# EAGLE design Schematic (EAGLE 9.5.2)
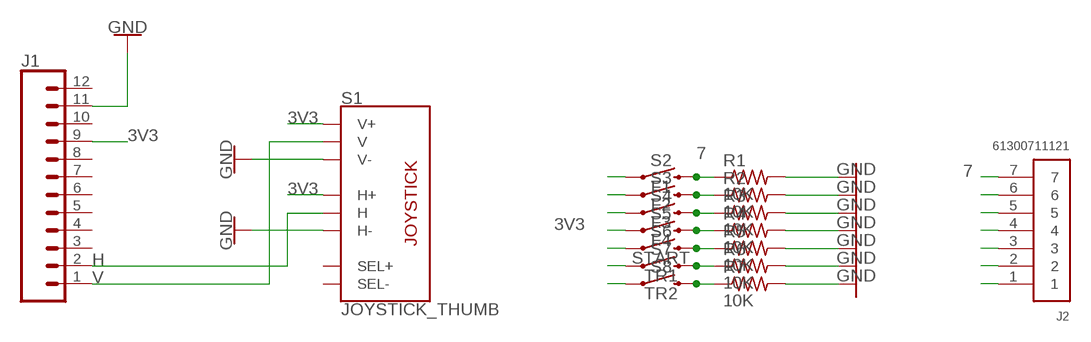
[diagram p0: schematic, sheet 1]

## Parts
J1  CONN_12NO_SILK  [1X12_NO_SILK]
J2  61300711121  [61300711121]
R1  10K  ERJ-8GEY0R00V  [RES_1206]
R2  10K  ERJ-8GEY0R00V  [RES_1206]
R3  10K  ERJ-8GEY0R00V  [RES_1206]
R4  10K  ERJ-8GEY0R00V  [RES_1206]
R5  10K  ERJ-8GEY0R00V  [RES_1206]
R6  10K  ERJ-8GEY0R00V  [RES_1206]
R7  10K  ERJ-8GEY0R00V  [RES_1206]
S1  JOYSTICK_THUMB  [JOYSTICK]
S2  F1  MOMENTARY-SWITCH-SPST-PTH-12MM  [TACTILE_SWITCH_PTH_12MM]
S3  F2  MOMENTARY-SWITCH-SPST-PTH-12MM  [TACTILE_SWITCH_PTH_12MM]
S4  F3  MOMENTARY-SWITCH-SPST-PTH-12MM  [TACTILE_SWITCH_PTH_12MM]
S5  F4  MOMENTARY-SWITCH-SPST-PTH-12MM  [TACTILE_SWITCH_PTH_12MM]
S6  START  MOMENTARY-SWITCH-SPST-PTH-12MM  [TACTILE_SWITCH_PTH_12MM]
S7  TR1  MOMENTARY-SWITCH-SPST-PTH-RIGHT-ANGLE-KIT  [TACTILE_SWITCH_PTH_RIGHT_ANGLE_KIT]
S8  TR2  MOMENTARY-SWITCH-SPST-PTH-RIGHT-ANGLE-KIT  [TACTILE_SWITCH_PTH_RIGHT_ANGLE_KIT]

## Nets
1: J2.1 R7.1 S8.2
2: J2.2 R6.1 S7.2
3: J2.3 R5.1 S6.3
3V3: J1.9 S1.H1(H+) S1.V1(V+) S2.1 S3.1 S4.1 S5.1 S6.1 S7.1 S8.1
4: J2.4 R4.1 S5.3
5: J2.5 R3.1 S4.3
6: J2.6 R2.1 S3.3
7: J2.7 R1.1 S2.3
GND: J1.11 R1.2 R2.2 R3.2 R4.2 R5.2 R6.2 R7.2 S1.H3(H-) S1.V3(V-)
H: J1.2 S1.H2(H)
V: J1.1 S1.V2(V)
Unconnected: J1.3 J1.4 J1.5 J1.6 J1.7 J1.8 J1.10 J1.12 S1.B1A(SEL+) S1.B2A(SEL-)

## Library data of the parts
J1 = SparkFun-Connectors:CONN_12: Multi connection point. Often used as Generic Header-pin footprint for 0.1 inch spaced/style header connections On any of the 0.1 inch spaced packages, you can populate with these: Break Away Headers - Straight <https://www.sparkfun.com/products/116> (PRT-00116) Break Away Male Headers - Right Angle <https://www.sparkfun.com/products/553> (PRT-00553) Female Headers <https://www.sparkfun.com/products/115> (PRT-00115) Break Away Headers - Machine Pin <https://www.sparkfun.com/products/117> (PRT-00117) Break Away Female Headers - Swiss Machine Pin <https://www.sparkfun.com/products/743> (PRT-00743) For SCREWTERMINALS and SPRING TERMINALS visit here: Screw Terimnals on SparkFun.com <https://www.sparkfun.com/search/results?term=Screw+Terminals> (5mm/3.5mm/2.54mm spacing) This device is also useful as a general connection point to wire up your design to another part of your project. Our various solder wires solder well into these plated through hole pads. Hook-Up Wire - Assortment (Stranded, 22 AWG) <https://www.sparkfun.com/products/11375> (PRT-11375) Hook-Up Wire - Assortment (Solid Core, 22 AWG) <https://www.sparkfun.com/products/11367> (PRT-11367) View the entire wire category on our website here <https://www.sparkfun.com/categories/141> Special notes: Molex polarized connector foot print use with SKU : PRT-08231 with associated crimp pins and housings. 1MM SMD Version SKU: PRT-10208 NOTES ON THE VARIANTS LOCK and LOCK_LONGPADS... This footprint was designed to help hold the alignment of a through-hole component (i.e. 6-pin header) while soldering it into place. You may notice that each hole has been shifted either up or down by 0.005 of an inch from it's more standard position (which is a perfectly straight line). This slight alteration caused the pins (the squares in the middle) to touch the edges of the holes. Because they are alternating, it causes a "brace" to hold the component in place. 0.005 has proven to be the perfect amount of "off-center" position when using our standard breakaway headers. Although looks a little odd when you look at the bare footprint, once you have a header in there, the alteration is very hard to notice. Also,if you push a header all the way into place, it is covered up entirely on the bottom side.
J2 = Headers:61300711121: CONN HEADER VERT 7POS 2.54MM Manufacturer's datasheet <https://katalog.we-online.de/em/datasheet/6130xx11121.pdf>; CREATED_BY: PCBLayout.com; DIGI_KEY_PART_NUMBER: 732-5320-ND; MANUFACTURER: Wurth Electronics Inc.; MPN: 61300711121
R1-R7 = Resistor_Capacitor:ERJ-8GEY0R00V: RES SMD 0 OHM JUMPER 1/4W 1206 Manufacturer's datasheet <https://industrial.panasonic.com/ww/products/resistors/chip-resistors/general-purpose-chip-resistors/thick-film-chip-resistors/ERJ8GEY0R00V>; CREATED_BY: PCBLayout.com; DIGIKEY_PART_NUMBER: P0.0ETR-ND; MANUFACTURER: Panasonic Electronic Components; MPN: ERJ-8GEY0R00V; PACKAGE: SMD 1206
S1 = SparkFun-Switches:JOYSTICK_THUMB: Analog Thumb Joystick This is a joystick very similar to the ‘analog’ joysticks on PS2 (PlayStation 2) controllers. Directional movements are simply two potentiometers - one for each axis. Pots are ~10k each. This joystick also has a select button that is actuated when the joystick is pressed down. SparkFun Products Thumb Joystick <https://www.sparkfun.com/products/9032> (COM-09032) SparkFun Thumb Joystick Breakout <https://www.sparkfun.com/products/9110> (BOB-09110) SparkFun Joystick Shield Kit <https://www.sparkfun.com/products/9760> (DEV-09760); PROD_ID: COMP-09744; SF_SKU: COM-09032
S2-S6 = SparkFun-Switches:MOMENTARY-SWITCH-SPST: Momentary Switch (Pushbutton) - SPST Normally-open (NO) SPST momentary switches (buttons, pushbuttons). Variants PTH-12MM - 12mm square, through-hole Momentary Pushbutton Switch - 12mm Square <https://www.sparkfun.com/products/9190> (COM-09190) PTH-6.0MM, PTH-6.0MM-KIT - 6.0mm square, through-hole Mini Pushbutton Switch <https://www.sparkfun.com/products/97> (COM-00097) KIT package intended for soldering kit's - only one side of pads' copper is exposed. PTH-RIGHT-ANGLE-KIT - Right-angle, through-hole Right Angle Tactile Button <https://www.sparkfun.com/products/10791> - Used on SparkFun BigTime Watch Kit <https://www.sparkfun.com/products/11734> SMD-12MM - 12mm square, surface-mount Tactile Button - SMD (12mm) <https://www.sparkfun.com/products/12993> (COM-12993) Used on SparkFun PicoBoard <https://www.sparkfun.com/products/11888> SMD-4.5MM - 4.5mm Square Trackball Switch Used on SparkFun Blackberry Trackballer Breakout <https://www.sparkfun.com/products/13169> SMD-4.6MMX2.8MM - 4.60mm x 2.80mm, surface mount Used on SparkFun SAMD21 Mini Breakout <https://www.sparkfun.com/products/13664> SMD-5.2MM, SMD-5.2-REDUNDANT - 5.2mm square, surface-mount Mini Pushbutton Switch - SMD <https://www.sparkfun.com/products/8720> (COM-08720) Used on Arduino Pro Mini <https://www.sparkfun.com/products/11114> REDUNDANT package connects both switch circuits together SMD-6.0X3.5MM - 6.0 x 3.5mm, surface mount Momentary Reset Switch SMD <https://www.sparkfun.com/products/8229> (COM-08229) SMD-6.2MM-TALL - 6.2mm square, surface mount Tactile Button - SMD (6mm) <https://www.sparkfun.com/products/12992> Used on SparkFun Digital Sandbox <https://www.sparkfun.com/products/12651> SMD-RIGHT-ANGLE - Right-angle, surface mount Used on SparkFun Block for Intel® Edison - Arduino <https://www.sparkfun.com/products/13036>; PROD_ID: SWCH-09185; SF_SKU: COM-09190
S7 S8 = SparkFun-Switches:MOMENTARY-SWITCH-SPST: Momentary Switch (Pushbutton) - SPST Normally-open (NO) SPST momentary switches (buttons, pushbuttons). Variants PTH-12MM - 12mm square, through-hole Momentary Pushbutton Switch - 12mm Square <https://www.sparkfun.com/products/9190> (COM-09190) PTH-6.0MM, PTH-6.0MM-KIT - 6.0mm square, through-hole Mini Pushbutton Switch <https://www.sparkfun.com/products/97> (COM-00097) KIT package intended for soldering kit's - only one side of pads' copper is exposed. PTH-RIGHT-ANGLE-KIT - Right-angle, through-hole Right Angle Tactile Button <https://www.sparkfun.com/products/10791> - Used on SparkFun BigTime Watch Kit <https://www.sparkfun.com/products/11734> SMD-12MM - 12mm square, surface-mount Tactile Button - SMD (12mm) <https://www.sparkfun.com/products/12993> (COM-12993) Used on SparkFun PicoBoard <https://www.sparkfun.com/products/11888> SMD-4.5MM - 4.5mm Square Trackball Switch Used on SparkFun Blackberry Trackballer Breakout <https://www.sparkfun.com/products/13169> SMD-4.6MMX2.8MM - 4.60mm x 2.80mm, surface mount Used on SparkFun SAMD21 Mini Breakout <https://www.sparkfun.com/products/13664> SMD-5.2MM, SMD-5.2-REDUNDANT - 5.2mm square, surface-mount Mini Pushbutton Switch - SMD <https://www.sparkfun.com/products/8720> (COM-08720) Used on Arduino Pro Mini <https://www.sparkfun.com/products/11114> REDUNDANT package connects both switch circuits together SMD-6.0X3.5MM - 6.0 x 3.5mm, surface mount Momentary Reset Switch SMD <https://www.sparkfun.com/products/8229> (COM-08229) SMD-6.2MM-TALL - 6.2mm square, surface mount Tactile Button - SMD (6mm) <https://www.sparkfun.com/products/12992> Used on SparkFun Digital Sandbox <https://www.sparkfun.com/products/12651> SMD-RIGHT-ANGLE - Right-angle, surface mount Used on SparkFun Block for Intel® Edison - Arduino <https://www.sparkfun.com/products/13036>; PROD_ID: CONN-10672; SF_SKU: COM-10791

## Board
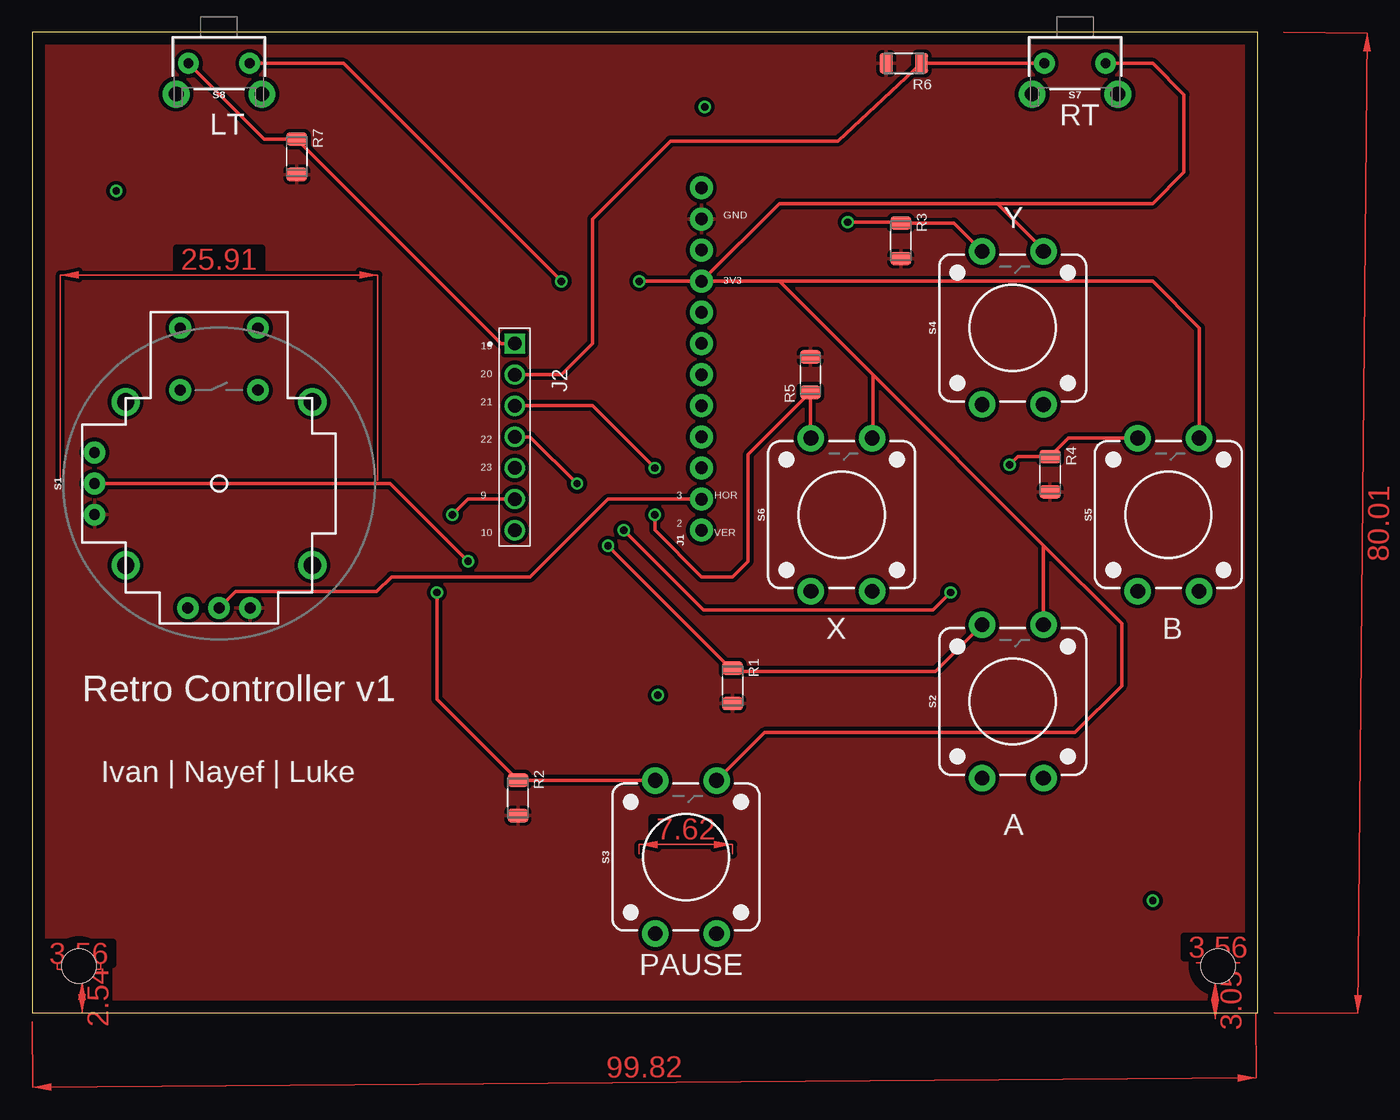
[diagram p1: board, top side]
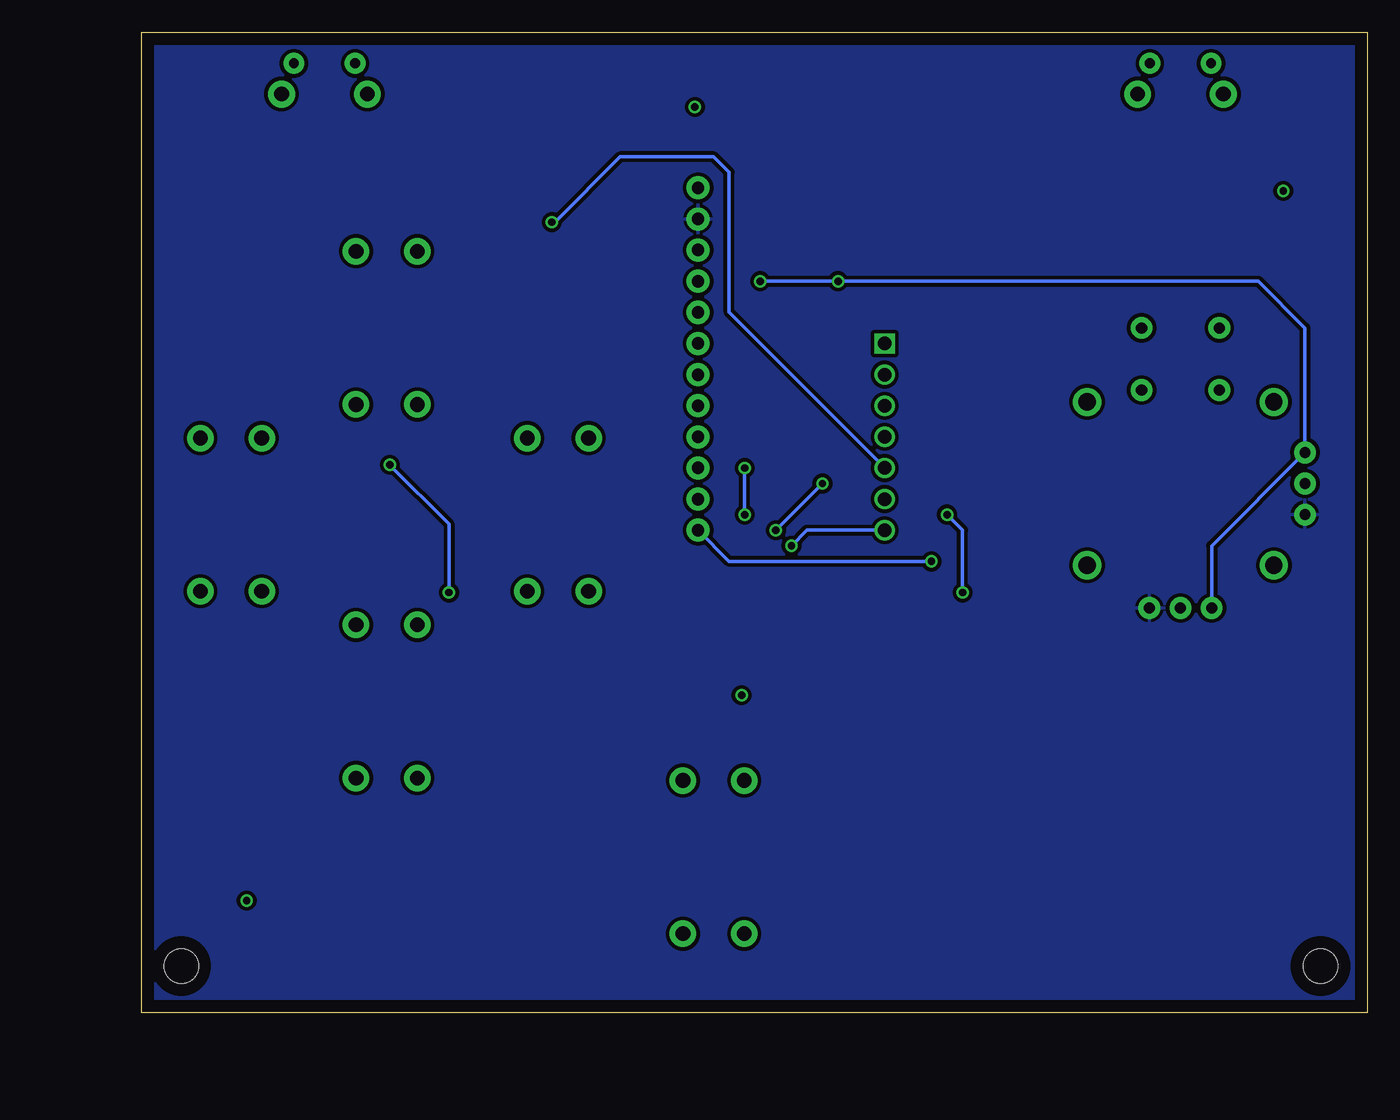
[diagram p2: board, bottom side, seen from below]

Size 100 x 80 mm. Coordinates in mm from the lower left corner, seen from the top.
Outline: 0,0 100,0 100,80 0,80 0,0
Copper layers (1*16): Top 0.035mm / dielectric 1.5mm / Bottom 0.035mm
Design rules "default *": minimum track width 12mil, minimum drill 0.6mm, track to track 12mil, track to pad 12mil, pad to pad 12mil, via to via 12mil, smd to smd 12mil, copper to edge 40mil, drill to drill 6mil, minimum pad ring 10mil, minimum via ring 8mil, stop-mask expansion 4mil, vias tented up to drill 0mil, thermal gap 10mil
Holes 2.8 mm at 3.81,3.81 96.77,3.81

### Footprints (pad centres in the part's own frame; a part is rotated, then mirrored left to right if it is on the bottom)
1X12_NO_SILK = drill 1.016 pad 1.88: 1 0,0; 2 2.54,0; 3 5.08,0; 4 7.62,0; 5 10.16,0; 6 12.7,0; 7 15.24,0; 8 17.78,0; 9 20.32,0; 10 22.86,0; 11 25.4,0; 12 27.94,0
61300711121 = drill 1.1 square: 1 -7.62,0 | drill 1.1: 2 -5.08,0; 3 -2.54,0; 4 0,0; 5 2.54,0; 6 5.08,0; 7 7.62,0
RES_1206 = smd 1.08 x 1.68: 1 -1.445,0; 2 1.445,0
JOYSTICK = drill 0.9 pad 1.778: B1A -3.175,12.7; B1B 3.175,12.7; B2A -3.175,7.62; B2B 3.175,7.62 | drill 0.889 pad 1.778: H1 -2.54,-10.16; H2 0,-10.16; H3 2.54,-10.16; V1 -10.16,2.54; V2 -10.16,0; V3 -10.16,-2.54 | drill 1.397 pad 2.286: MOUNT1 -7.62,6.668; MOUNT2 -7.62,-6.668; MOUNT3 7.62,-6.668; MOUNT4 7.62,6.668
TACTILE_SWITCH_PTH_12MM = drill 1.2 pad 2.159: 1 6.25,-2.5; 2 -6.25,-2.5; 3 6.25,2.5; 4 -6.25,2.5
TACTILE_SWITCH_PTH_RIGHT_ANGLE_KIT = drill 0.8 pad 1.7: 1 -2.5,0; 2 2.5,0 | drill 1.2 pad 2.2: ANCHOR1 -3.5,2.5; ANCHOR2 3.5,2.5

### Placement (x,y rotation side)
J1  54.61,39.37 90 top
J2  39.37,46.99 270 top
R1  57.15,26.67 270 top
R2  39.62,17.53 270 top
R3  70.87,62.99 270 top
R4  83.06,43.94 270 top
R5  63.5,52.07 90 top
R6  71.12,77.47 180 top
R7  21.59,69.85 270 top
S1  15.24,43.18 0 top
S2  80.01,25.4 90 top
S3  53.34,12.7 90 top
S4  80.01,55.88 90 top
S5  92.71,40.64 90 top
S6  66.04,40.64 90 top
S7  85.09,77.47 180 top
S8  15.24,77.47 180 top

### Tracks (layer width: path | path; a pad name or v marks a point on that pad's centre or on a via)
1
  Top 0.305: J2.1 38.27,54.61 R7.1 18.91,71.3 S8.2
2
  Top 0.305: S7.2 R6.1 65.75,71.12 52.07,71.12 45.72,64.77 45.72,54.61 43.18,52.07 J2.2
3  (via drill 0.6)
  Top 0.305: S6.3 63.5,46.93 R5.1 58.42,45.55 58.42,36.83 57.15,35.56 54.61,35.56 50.8,39.37 v50.8,40.64 | v50.8,44.45 45.72,49.53 J2.3
  Bottom 0.305: v50.8,40.64 v50.8,44.45
3V3  (via drill 0.6)
  Top 0.305: J1.9 60.96,59.69 | 60.96,59.69 68.58,52.07 | 68.58,52.07 68.58,46.93 S6.1 | J1.9 60.96,66.04 78.74,66.04 | 78.74,66.04 82.51,62.27 S4.1 | 60.96,59.69 91.44,59.69 95.25,55.88 95.25,46.93 S5.1 | 68.58,52.07 82.51,38.14 | 82.51,38.14 S2.1 | 82.51,38.14 88.9,31.75 88.9,26.67 85.09,22.86 59.75,22.86 S3.1 | 78.74,66.04 91.44,66.04 93.98,68.58 93.98,74.93 91.44,77.47 S7.1 | J1.9 v49.53,59.69 | v43.18,59.69 25.4,77.47 S8.1
  Bottom 0.305: v49.53,59.69 v43.18,59.69 8.89,59.69 5.08,55.88 S1.V1 12.7,38.1 S1.H1
4  (via drill 0.6)
  Top 0.305: v74.93,34.29 73.49,32.85 54.78,32.85 v48.26,39.37 | v44.45,43.18 40.64,46.99 J2.4 | v79.76,44.7 80.44,45.39 R4.1 84.56,46.89 S5.3
  Bottom 0.305: v48.26,39.37 v44.45,43.18 | v79.76,44.7 74.93,39.88 v74.93,34.29
5  (via drill 0.6)
  Top 0.305: S4.3 75.2,64.44 R3.1 70.79,64.52 v66.55,64.52
  Bottom 0.305: J2.5 52.07,57.15 52.07,68.58 53.34,69.85 60.96,69.85 66.29,64.52 v66.55,64.52
6  (via drill 0.6)
  Top 0.305: v34.29,40.64 35.56,41.91 J2.6 | S3.3 39.65,18.95 R2.1 33.02,25.57 v33.02,34.29
  Bottom 0.305: v33.02,34.29 33.02,39.37 v34.29,40.64
7  (via drill 0.6)
  Top 0.305: S2.3 73.7,27.84 57.34,27.84 R1.1 57,28.09 v46.99,38.1
  Bottom 0.305: v46.99,38.1 45.72,39.37 J2.7
GND
  pour Top: 0,80.01 100.33,80.01 100.33,0 0,0
  pour Bottom: 0,80.01 100.58,80.01 100.58,0 0.76,0 0,-0.76 0,79.25
H
  Top 0.305: J1.2 46.99,41.91 40.64,35.56 29.31,35.56 28.12,34.37 16.59,34.37 S1.H2
N$1  (via drill 0.6)
  other vias: 6.86,67.06
N$2  (via drill 0.6)
  other vias: 51.05,25.91
N$3  (via drill 0.6)
  other vias: 91.44,9.14
N$4  (via drill 0.6)
  other vias: 54.86,73.91
V  (via drill 0.6)
  Top 0.305: S1.V2 29.21,43.18 v35.56,36.83
  Bottom 0.305: v35.56,36.83 52.07,36.83 J1.1
(copper drawn outside any net)
  shapes: Top area x8

### Text on the board
tNames: LT | RT | GND | Y | 3V3 | 19 | 20 | 21 | 22 | 23 | 9 | 3 | HOR | 2 | 10 | VER | X | B | Retro Controller v1 | Ivan | Nayef | Luke | A | PAUSE